# Altium project Mini Voltmeter.PrjPcb
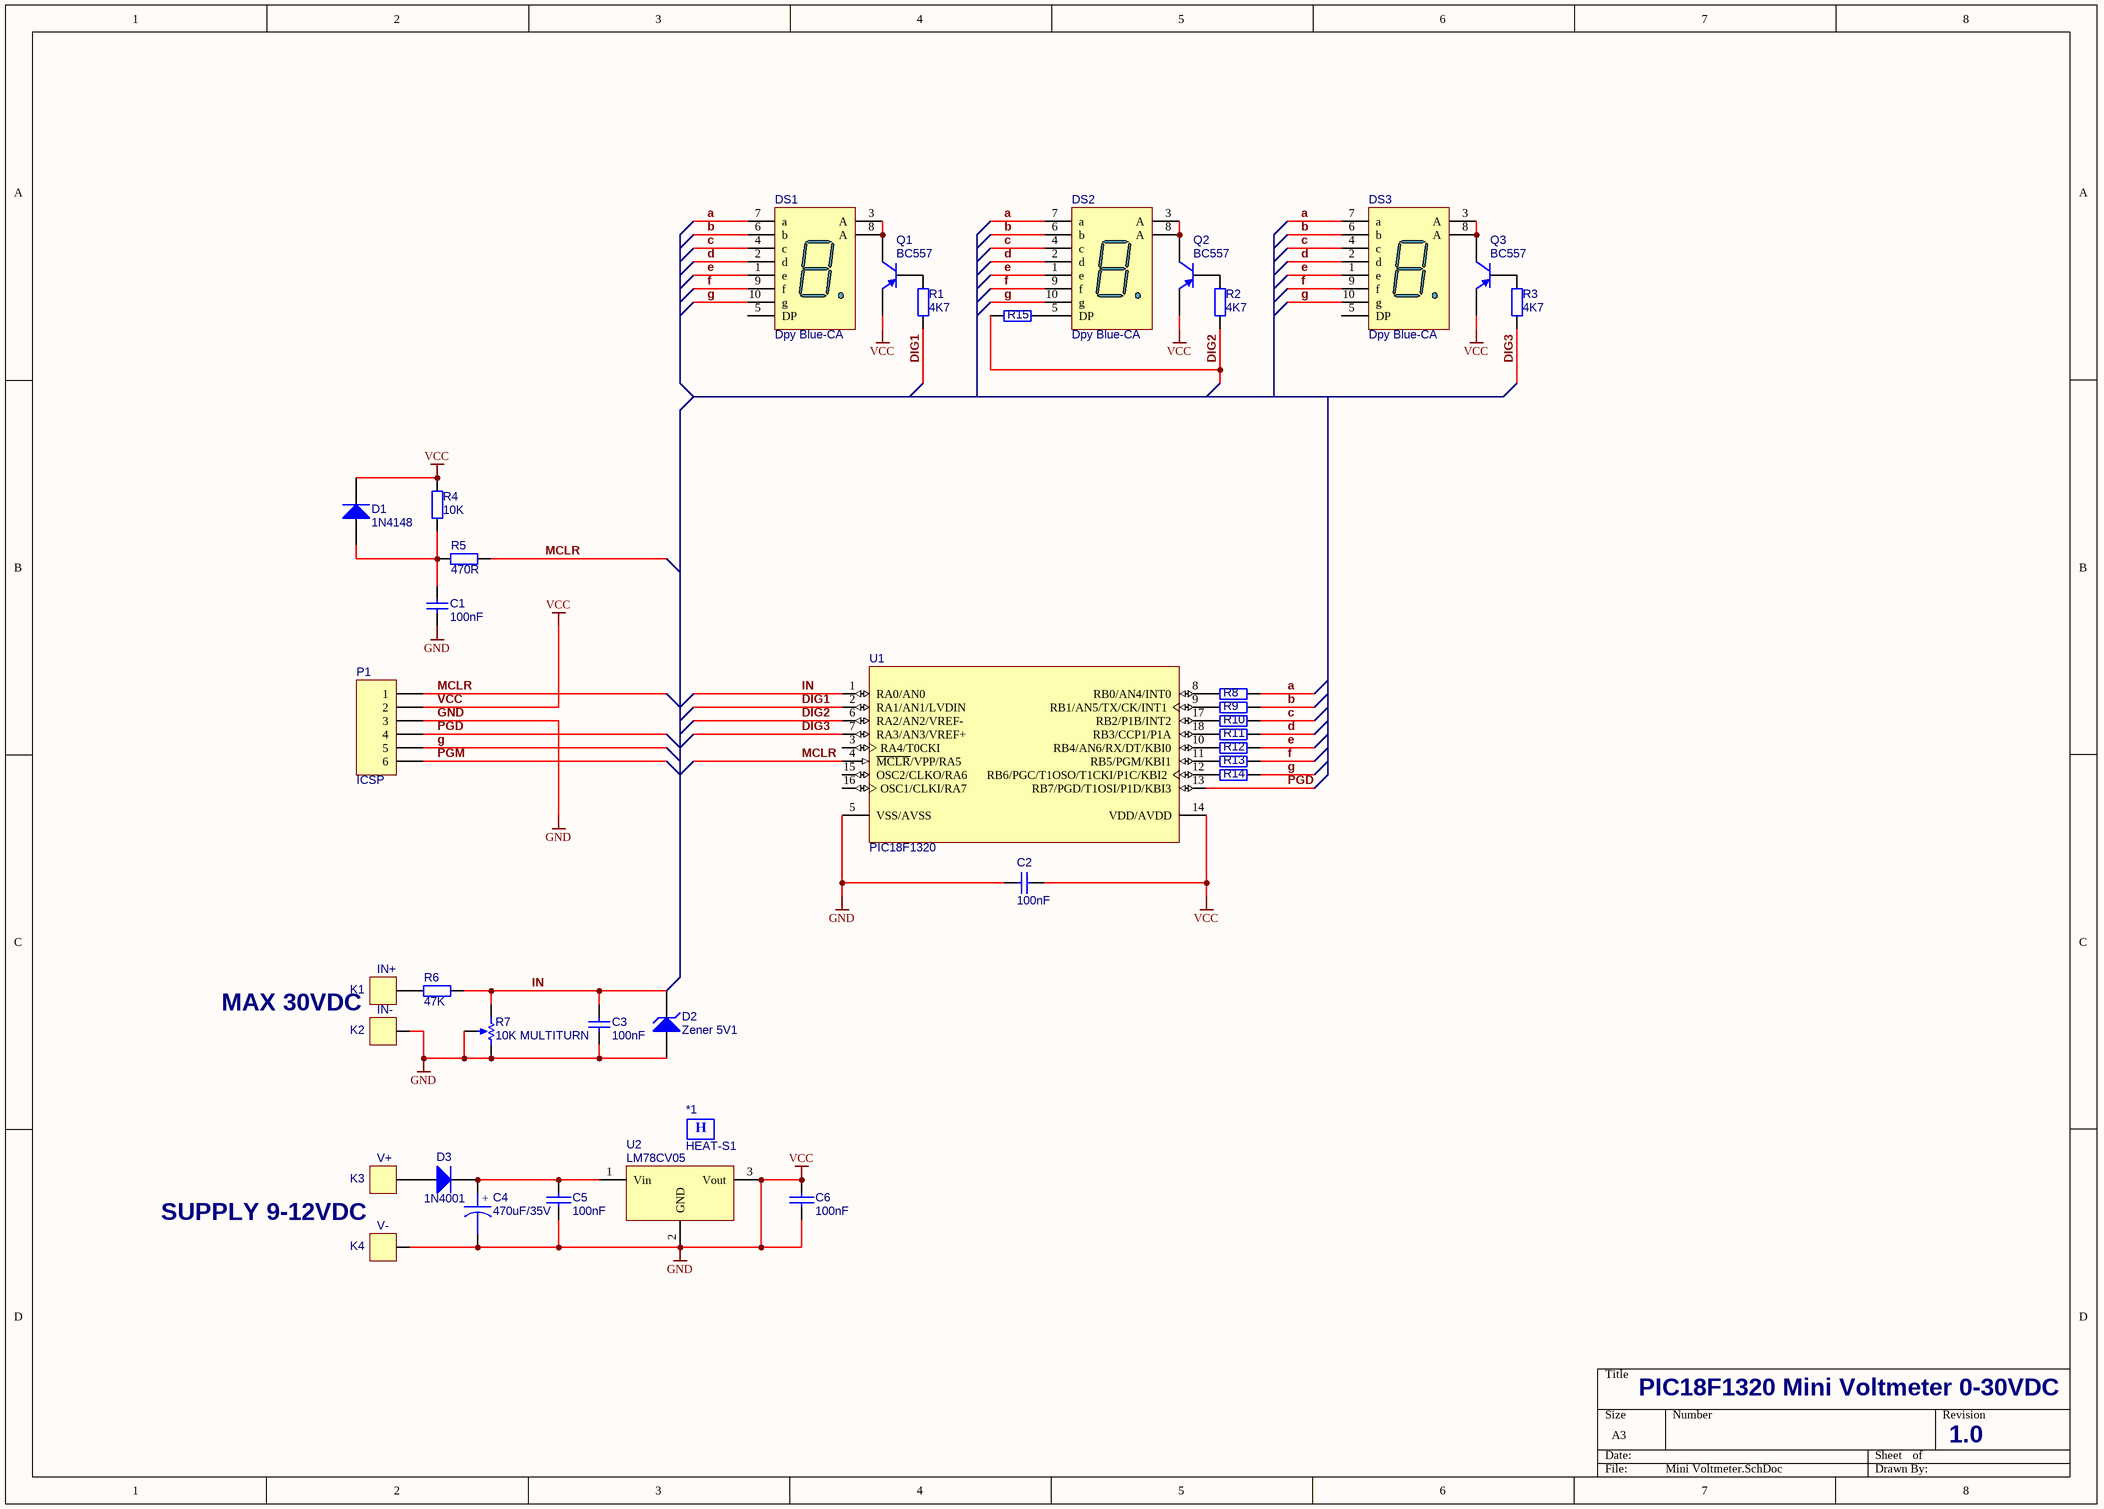
[diagram p0: Mini Voltmeter.SchDoc]
1 sheet, 38 parts. Net scope: global (net labels, ports and power ports of the same name join across sheets).

## Sheet Mini Voltmeter.SchDoc
size A3

### Parts
*1  HEAT-S1  [Heat_Sink1]
C1  100nF  [RAD-0.3]
C2  100nF  [RAD-0.3]
C3  100nF  [RAD-0.3]
C4  470uF/35V  [RB-10]
C5  100nF  [RAD-0.1]
C6  100nF  [RAD-0.1]
D1  1N4148  [DO-35]
D2  Zener 5V1  [DIODE-0.4]
D3  1N4001  [DO-35]
DS1  Dpy Blue-CA  [H]
DS2  Dpy Blue-CA  [H]
DS3  Dpy Blue-CA  [H]
K1  IN+  [CON2]
K2  IN-  [CON2]
K3  V+  [CON2]
K4  V-  [CON2]
P1  ICSP  [HDR1X6]
Q1  BC557  [SOT54]
Q2  BC557  [SOT54]
Q3  BC557  [SOT54]
R1  4K7  [AXIAL-0.4]
R2  4K7  [AXIAL-0.4]
R3  4K7  [AXIAL-0.4]
R4  10K  [AXIAL-0.4]
R5  470R  [AXIAL-0.4]
R6  47K  [AXIAL-0.4]
R7  10K MULTITURN  [VR5]
R8  220R  [AXIAL-0.4]  (value not drawn)
R9  220R  [AXIAL-0.4]  (value not drawn)
R10  220R  [AXIAL-0.4]  (value not drawn)
R11  220R  [AXIAL-0.4]  (value not drawn)
R12  220R  [AXIAL-0.4]  (value not drawn)
R13  220R  [AXIAL-0.4]  (value not drawn)
R14  220R  [AXIAL-0.4]  (value not drawn)
R15  220R  [AXIAL-0.4]  (value not drawn)
U1  PIC18F1320  [PDIP300-18]
U2  LM78CV05  [to-220]

### Nets
GND: C1.1 C2.1 C2.2 C3.1 C4.2 C5.2 C6.1 C6.2 D1.2(K) D2.1(A) K2.1 K4.1 P1.2 P1.3 Q1.1(E) Q2.1(E) Q3.1(E) R4.2 R7.2(BOT) R7.3(TAP) U1.5(VSS/AVSS) U1.14(VDD/AVDD) U2.2(GND) U2.3(Vout)  [also labelled VCC]
a: DS1.7(a) DS2.7(a) DS3.7(a) R8.1
b: DS1.6(b) DS2.6(b) DS3.6(b) R9.1
c: DS1.4(c) DS2.4(c) DS3.4(c) R10.1
d: DS1.2(d) DS2.2(d) DS3.2(d) R11.1
DIG1: R1.1 U1.2(RA1/AN1/LVDIN)
DIG2: R2.1 R15.2 U1.6(RA2/AN2/VREF-)
DIG3: R3.1 U1.7(RA3/AN3/VREF+)
e: DS1.1(e) DS2.1(e) DS3.1(e) R12.1
f: DS1.9(f) DS2.9(f) DS3.9(f) R13.1
g: DS1.10(g) DS2.10(g) DS3.10(g) P1.5 R14.1
IN: C3.2 D2.2(K) R6.1 R7.1(TOP) U1.1(RA0/AN0)
MCLR: P1.1 R5.1 U1.4(~{MCLR}/VPP/RA5)
PGD: P1.4 U1.13(RB7/PGD/T1OSI/P1D/KBI3)
PGM: P1.6
NetC1_2: C1.2 D1.1(A) R4.1 R5.2
NetC4_1: C4.1 C5.1 D3.2(K) U2.1(Vin)
NetD3_1: D3.1(A) K3.1
NetDS1_3: DS1.3(A) DS1.8(A) Q1.3(C)
NetDS2_3: DS2.3(A) DS2.8(A) Q2.3(C)
NetDS2_5: DS2.5(DP) R15.1
NetDS3_3: DS3.3(A) DS3.8(A) Q3.3(C)
NetK1_1: K1.1 R6.2
NetQ1_2: Q1.2(B) R1.2
NetQ2_2: Q2.2(B) R2.2
NetQ3_2: Q3.2(B) R3.2
NetR8_2: R8.2 U1.8(RB0/AN4/INT0)
NetR9_2: R9.2 U1.9(RB1/AN5/TX/CK/INT1)
NetR10_2: R10.2 U1.17(RB2/P1B/INT2)
NetR11_2: R11.2 U1.18(RB3/CCP1/P1A)
NetR12_2: R12.2 U1.10(RB4/AN6/RX/DT/KBI0)
NetR13_2: R13.2 U1.11(RB5/PGM/KBI1)
NetR14_2: R14.2 U1.12(RB6/PGC/T1OSO/T1CKI/P1C/KBI2)

Not connected (* = marked no-connect by the designer): DS1 5(DP); DS3 5(DP); U1 3(RA4/T0CKI) 15(OSC2/CLKO/RA6) 16(OSC1/CLKI/RA7)

### Notes on the sheet
- MAX 30VDC
- SUPPLY 9-12VDC
- PIC18F1320 Mini Voltmeter 0-30VDC
- 1.0
- (in symbol CAPACITOR POL) +
- (in symbol HEAT-S1) H

### Library data of the parts
C1-C3 = Cap: Capacitor; Value: 100pF; Published: 8-Jun-2000; LatestRevisionDate: 17-Jul-2002; LatestRevisionNote: Re-released for DXP Platform.; PackageReference: RAD-0.3; Publisher: Altium Limited
C4 = CAPACITOR POL: Capacitor
C5 C6 = CAP: Capacitor
D1 D3 = Diode 1N914: High Conductance Fast Diode; Published: 8-Jun-2000; LatestRevisionDate: 17-Jul-2002; LatestRevisionNote: Re-released for DXP Platform.; DatasheetDocument: 1997; PackageReference: DO-35; Publisher: Altium Limited; Code_JEDEC: DO-204-AH; ComponentLink1Description: Manufacturer Link; ComponentLink1URL: http://www.fairchildsemi.com/; ComponentLink2Description: Datasheet; ComponentLink2URL: http://www.fairchildsemi.com/ds/1N%2F1N4448.pdf
D2 = D Zener: Zener Diode; Published: 8-Jun-2000; LatestRevisionDate: 17-Jul-2002; LatestRevisionNote: Re-released for DXP Platform.; PackageReference: DIODE-0.7; Publisher: Altium Limited
DS1-DS3 = Dpy Blue-CA: 14.2 mm General Purpose Blue 7-Segment Display: CA, RH DP, Gray Surface; MinimumIntensity: 2020 ucd; Note: IF = 10 mA; Published: 8-Jun-2000; LatestRevisionDate: 17-Dec-2003; LatestRevisionNote: Schematic revised, PCB Footprint replaced.; DatasheetDocument: 24-Sep-2002; PackageDocument: 24-Sep-2002; PackageReference: H; Publisher: Altium Limited; Colour: Blue; ComponentLink1Description: Manufacturer Link; ComponentLink1URL: http://www.agilent.com/
K1-K4 = CON1: Connector
P1 = Header 6: Header, 6-Pin; LatestRevisionDate: 17-Jul-2002; LatestRevisionNote: Re-released for DXP Platform.; Publisher: Altium Limited
Q1-Q3 = BC557: PNP General-purpose Transistor; Published: 17-Sep-2003; LatestRevisionDate: 12-Dec-2006; LatestRevisionNote: Footprint pad sequence fixed.; DatasheetVersion: 15-Apr-1999; PackageVersion: Feb-1997; PackageReference: SOT54; Publisher: Altium Limited; PackageDescription: Plastic Single-Ended Leaded (through hole) package; 3 Leads (TO-92); Code_JEITA: SC-43; Code_JEDEC: TO-92; ComponentLink1Description: Manufacturer Link; ComponentLink1URL: http://www.semiconductors.philips.com/; ComponentLink2Description: Datasheet; ComponentLink2URL: http://www.semiconductors.philips.com/acrobat/datasheets/BC556_557_3.pdf
R1-R6 R8-R15 = Res2: Resistor; Value: 1K; Published: 8-Jun-2000; LatestRevisionDate: 17-Jul-2002; LatestRevisionNote: Re-released for DXP Platform.; PackageReference: AXIAL-0.4; Publisher: Altium Limited
R7 = RPot: Potentiometer; Sim Note: Enter the Resistance value and the set point into parameter fields.; Set Position: 0.5; Value: 1K; Published: 8-Jun-2000; LatestRevisionDate: 17-Jul-2002; LatestRevisionNote: Re-released for DXP Platform.; PackageReference: VR5; Publisher: Altium Limited
U1 = PIC18F1320-E/P: High Performance, Enhanced FLASH Microcontroller with 10-Bit A/D and nanoWatt Technology, 8K FLASH, 18-Pin PDIP, Standard Volt Range, Extended Temperature; Note: RA5 is available only when the M\C\L\R\ Resets are disabled.; Note: OSC1, OSC2, CLKI and CLKO are only available in select Oscillator modes and when these pins are not being used as digital I/O.; Published: 11-Oct-2004; LatestRevisionDate: 04-Mar-2005; LatestRevisionNote: Stylized 3D Model Added.; DatasheetVersion: DS39605B_2002; PackageVersion: 2003; PackageReference: PDIP300-18; Publisher: Altium Limited; PackageDescription: DIP, Plastic; 18 Leads; Row Spacing 7.62 mm; Pitch 2.54 mm; Code_JEDEC: MS-001; ComponentLink1Description: Manufacturer Link; ComponentLink1URL: http://www.microchip.com; ComponentLink2Description: Datasheet; ComponentLink2URL: http://ww1.microchip.com/downloads/en/DeviceDoc/39605b.pdf; ComponentLink3Description: Packaging Specification; ComponentLink3URL: http://ww1.microchip.com/downloads/en/PackagingSpec/00049AD.pdf
U2 = VOLTREG